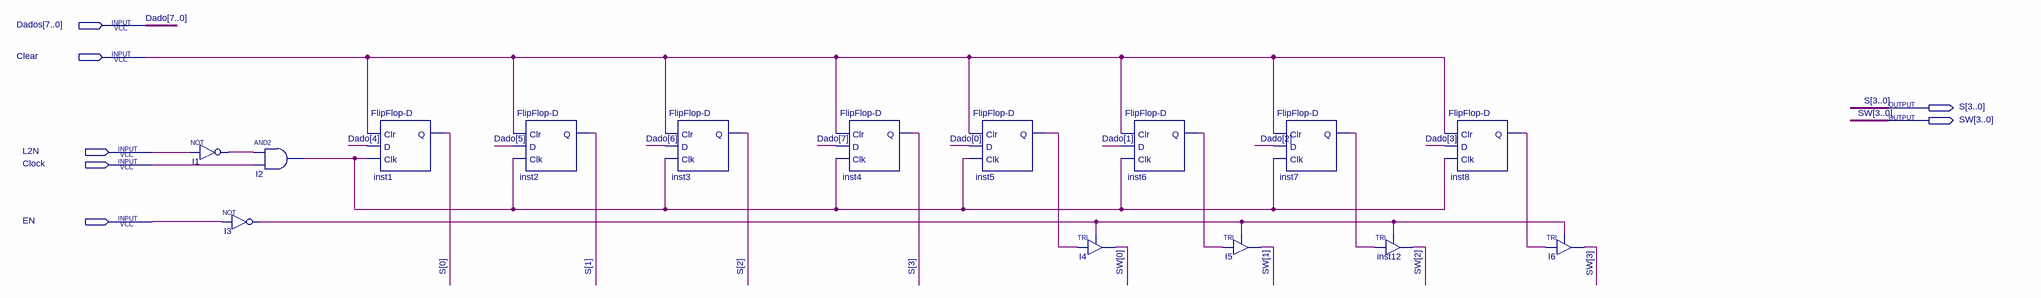
[diagram p0: schematic sheet]
// Quartus schematic Registrador-de-Instrucoes.bdf as structural Verilog: 15 symbols, 7 pins
module \Registrador-de-Instrucoes  (
  input  [7:0] Dados,
  input  Clear,
  input  L2N,
  input  Clock,
  input  EN,
  output [3:0] S,
  output [3:0] SW
);

  wire I1_out, I2_out, I3_out, inst5_q, inst6_q, inst7_q, inst8_q;

  not I1 (I1_out, L2N);
  and I2 (I2_out, I1_out, Clock);
  not I3 (I3_out, EN);
  \FlipFlop-D  inst1 (.Clr(Clear), .D(Dados[4]), .Clk(I2_out), .Q(S[0]));
  \FlipFlop-D  inst2 (.Clr(Clear), .D(Dados[5]), .Clk(I2_out), .Q(S[1]));
  \FlipFlop-D  inst3 (.Clr(Clear), .D(Dados[6]), .Clk(I2_out), .Q(S[2]));
  \FlipFlop-D  inst4 (.Clr(Clear), .D(Dados[7]), .Clk(I2_out), .Q(S[3]));
  \FlipFlop-D  inst5 (.Clr(Clear), .D(Dados[0]), .Clk(I2_out), .Q(inst5_q));
  TRI I4 (.IN(inst5_q), .OE(I3_out), .OUT(SW[0]));
  \FlipFlop-D  inst6 (.Clr(Clear), .D(Dados[1]), .Clk(I2_out), .Q(inst6_q));
  TRI I5 (.IN(inst6_q), .OE(I3_out), .OUT(SW[1]));
  \FlipFlop-D  inst7 (.Clr(Clear), .D(Dados[2]), .Clk(I2_out), .Q(inst7_q));
  TRI inst12 (.IN(inst7_q), .OE(I3_out), .OUT(SW[2]));
  \FlipFlop-D  inst8 (.Clr(Clear), .D(Dados[3]), .Clk(I2_out), .Q(inst8_q));
  TRI I6 (.IN(inst8_q), .OE(I3_out), .OUT(SW[3]));

  // Other names for the same wires on the sheet: Dado[7:0] = Dados
endmodule
